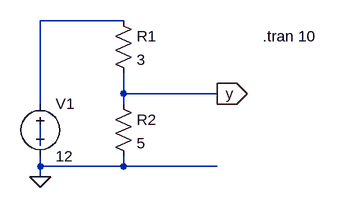
[diagram p0: schematic Draft1.asc]
Draft1.asc, the LTspice schematic file:
Version 4
SHEET 1 880 680
WIRE 96 -880 -32 -880
WIRE 96 -768 96 -800
WIRE 240 -768 96 -768
WIRE -32 -752 -32 -880
WIRE 96 -752 96 -768
WIRE -32 -688 -32 -720
WIRE -32 -656 -32 -672
WIRE 96 -656 96 -672
WIRE 96 -656 -32 -656
WIRE 240 -656 96 -656
WIRE -32 -640 -32 -656
FLAG -32 -640 0
FLAG 240 -768 y
IOPIN 240 -768 Out
SYMBOL voltage -32 -768 R0
WINDOW 123 0 0 Left 0
WINDOW 39 0 0 Left 0
SYMATTR InstName V1
SYMATTR Value 12
SYMBOL res 80 -896 R0
SYMATTR InstName R1
SYMATTR Value 3
SYMBOL res 80 -768 R0
SYMATTR InstName R2
SYMATTR Value 5
TEXT 310 -856 Left 2 !.tran 10

The netlist it stands for:
* Draft1.asc
V1 N001 0 12
R1 N001 y 3
R2 y 0 5
.tran 10
.backanno
.end